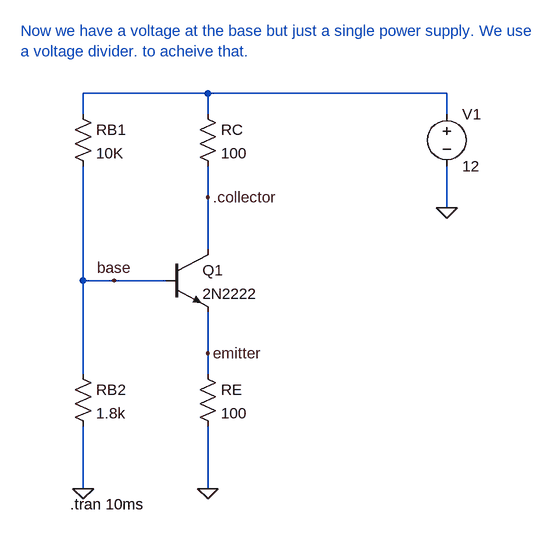
[diagram p0: schematic BaseBias05.asc]
BaseBias05.asc, the LTspice schematic file:
Version 4
SHEET 1 880 680
WIRE 240 -128 48 -128
WIRE 608 -128 240 -128
WIRE 48 -96 48 -128
WIRE 240 -96 240 -128
WIRE 608 -96 608 -128
WIRE 240 32 240 -16
WIRE 608 48 608 -16
WIRE 240 112 240 32
WIRE 48 160 48 -16
WIRE 96 160 48 160
WIRE 176 160 96 160
WIRE 240 272 240 208
WIRE 48 304 48 160
WIRE 240 304 240 272
WIRE 48 480 48 384
WIRE 240 480 240 384
FLAG 240 480 0
FLAG 48 480 0
FLAG 608 48 0
FLAG 240 272 emitter
FLAG 240 32 .collector
FLAG 96 160 base
SYMBOL npn 176 112 R0
SYMATTR InstName Q1
SYMATTR Value 2N2222
SYMBOL res 224 -112 R0
SYMATTR InstName RC
SYMATTR Value 100
SYMBOL res 224 288 R0
SYMATTR InstName RE
SYMATTR Value 100
SYMBOL res 32 288 R0
SYMATTR InstName RB2
SYMATTR Value 1.8k
SYMBOL res 32 -112 R0
SYMATTR InstName RB1
SYMATTR Value 10K
SYMBOL voltage 608 -112 R0
WINDOW 123 0 0 Left 0
WINDOW 39 0 0 Left 0
SYMATTR InstName V1
SYMATTR Value 12
TEXT 28 504 Left 2 !.tran 10ms
TEXT -48 -224 Left 2 ;Now we have a voltage at the base but just a single power supply. We use\na voltage divider. to acheive that.

The netlist it stands for:
* BaseBias05.asc
Q1 .collector base emitter 0 2N2222
RC N001 .collector 100
RE emitter 0 100
RB2 base 0 1.8k
RB1 N001 base 10K
V1 N001 0 12
.model NPN NPN
.model PNP PNP
.lib standard.bjt
.tran 10ms
* Now we have a voltage at the base but just a single power supply. We use
* a voltage divider. to acheive that.
.backanno
.end